# EAGLE design LED_Light_RS232_ZG (EAGLE 6.5.0)
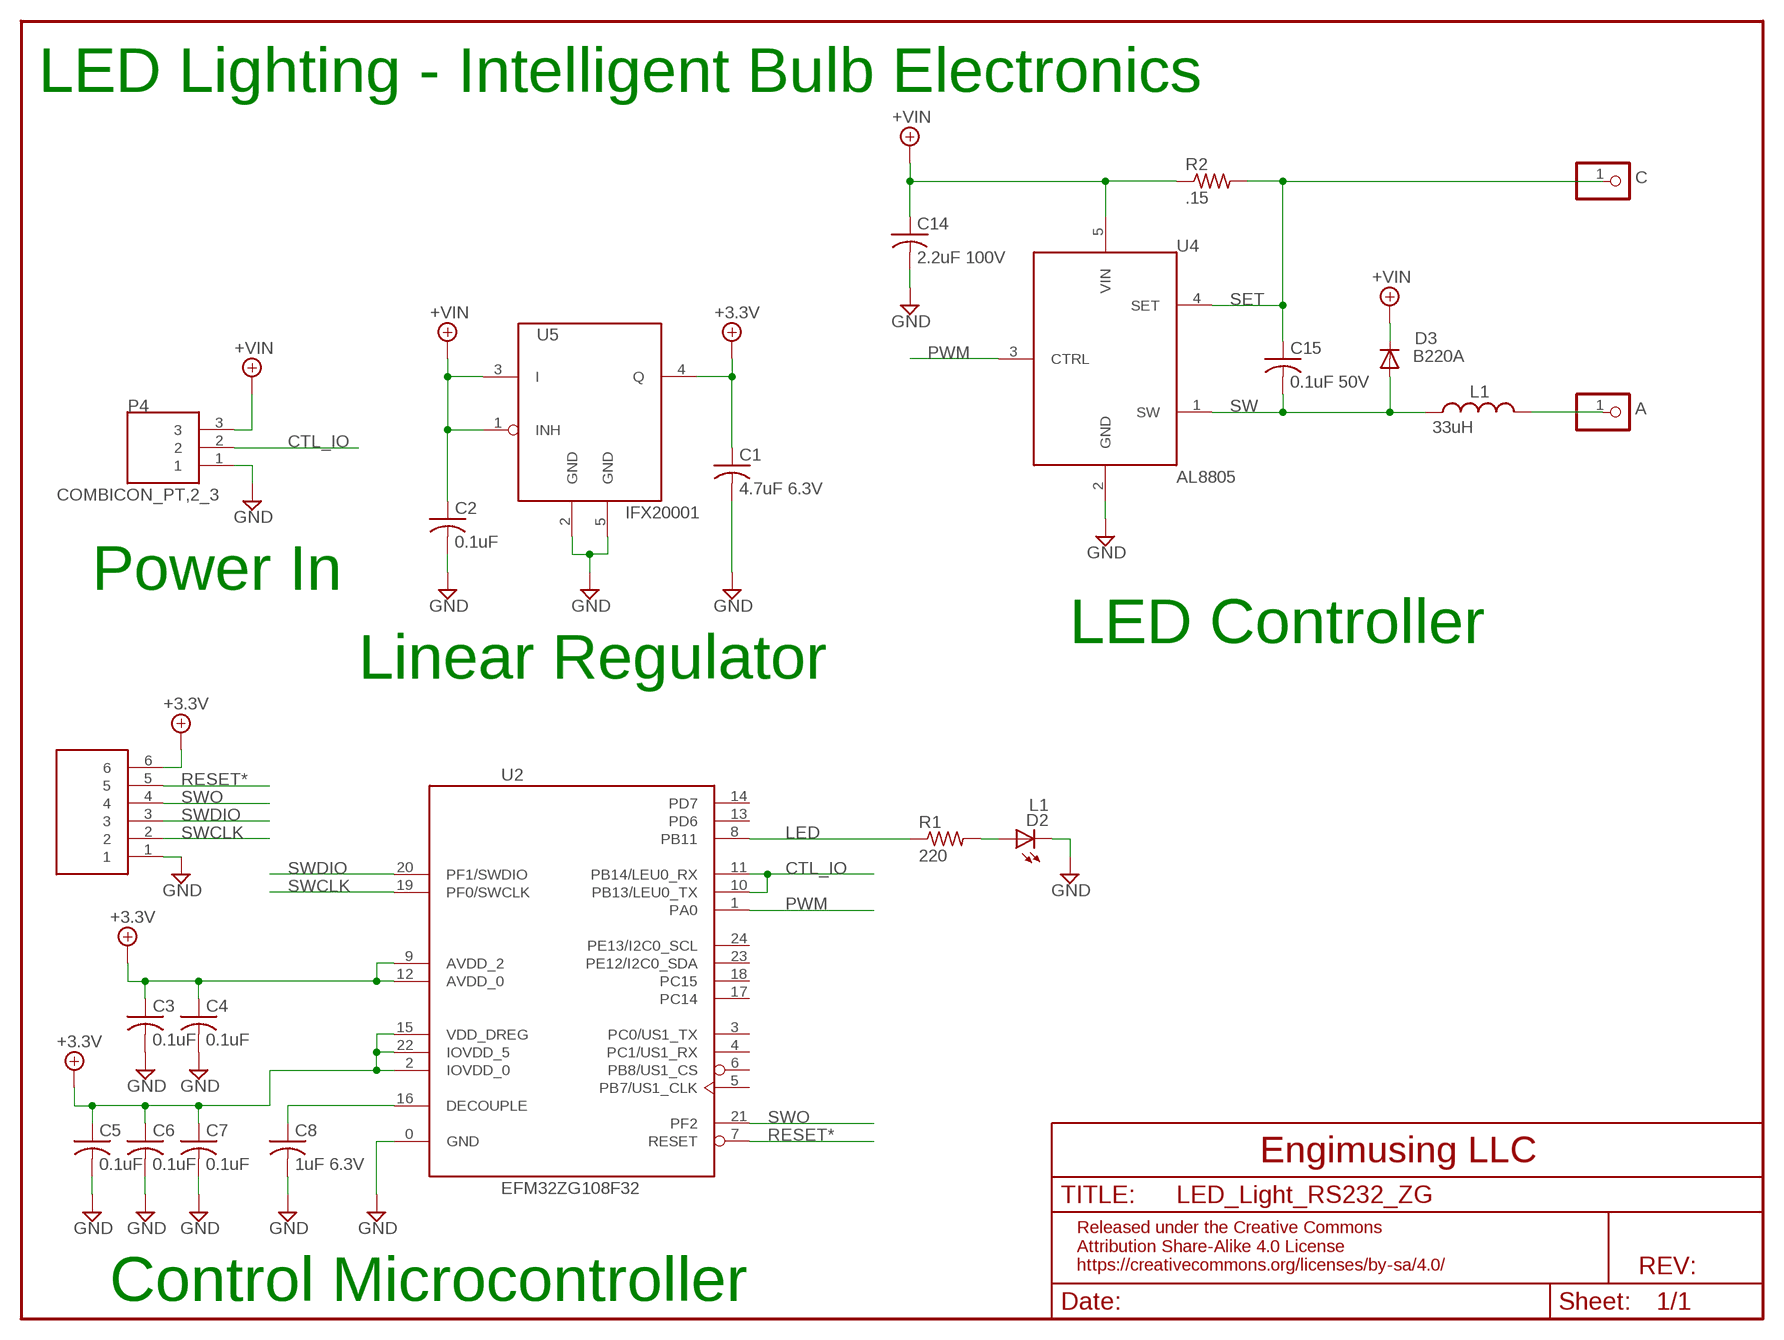
[diagram p0: schematic, sheet 1]

## Parts
A  PINHD-1X1  [1X01]
C  PINHD-1X1  [1X01]
C1  4.7uF 6.3V  C-USC0603  [C0603]
C2  0.1uF  C-USC0603  [C0603]
C3  0.1uF  C-USC0402  [C0402]
C4  0.1uF  C-USC0402  [C0402]
C5  0.1uF  C-USC0402  [C0402]
C6  0.1uF  C-USC0402  [C0402]
C7  0.1uF  C-USC0402  [C0402]
C8  1uF 6.3V  C-USC0603  [C0603]
C14  2.2uF 100V  C-USC1210K  [C1210K]
C15  0.1uF 50V  C-USC0603  [C0603]
D2  L1  LEDCHIP-LED0603  [CHIP-LED0603]
D3  B220A  DIODE  [DO214SMA]
L1  33uH  INDUCTOR  [SRN6045]
P3  DF11-6_STRAIGHT_PIN  [DF11SP-6-H]
P4  COMBICON_PT,2_3  [PT_2,5/3-5,0-H]
R1  220  R-USR0402  [R0402]
R2  .15  R-USR0805  [R0805]
U2  EFM32ZG108F32  [QFN24_5X5]
U4  AL8805  [SOT-23-5A]
U5  IFX20001  [PG-SCT595-5]

## Nets
+3.3V: C1.1 C3.1 C4.1 C5.1 C6.1 C7.1 P3.6 U2.2(IOVDD_0) U2.9(AVDD_2) U2.12(AVDD_0) U2.15(VDD_DREG) U2.22(IOVDD_5) U5.4(Q)
+VIN: C2.1 C14.1 D3.1(C) P4.3 R2.1 U4.5(VIN) U5.1(INH) U5.3(I)
CTL_IO: P4.2 U2.10(PB13/LEU0_TX) U2.11(PB14/LEU0_RX)
GND: C1.2 C2.2 C3.2 C4.2 C5.2 C6.2 C7.2 C8.2 C14.2 D2.C P3.1 P4.1 U2.0(GND) U4.2(GND) U5.2(GND) U5.5(GND)
LED: R1.1 U2.8(PB11)
N$1: C8.1 U2.16(DECOUPLE)
N$4: A.1 L1.2
N$5: D2.A R1.2
PWM: U2.1(PA0) U4.3(CTRL)
RESET*: P3.5 U2.7(RESET)
SET: C15.1 C.1 R2.2 U4.4(SET)
SW: C15.2 D3.2(A) L1.1 U4.1(SW)
SWCLK: P3.2 U2.19(PF0/SWCLK)
SWDIO: P3.3 U2.20(PF1/SWDIO)
SWO: P3.4 U2.21(PF2)
Unconnected: U2.3(PC0/US1_TX) U2.4(PC1/US1_RX) U2.5(PB7/US1_CLK) U2.6(PB8/US1_CS) U2.13(PD6) U2.14(PD7) U2.17(PC14) U2.18(PC15) U2.23(PE12/I2C0_SDA) U2.24(PE13/I2C0_SCL)

## Notes on the sheet
- LED Lighting - Intelligent Bulb Electronics
- Power In
- LED Controller
- Linear Regulator
- Control Microcontroller

## Library data of the parts
A C = pinhead:PINHD-1X1: PIN HEADER
C1 C2 C8 C14 = Engimusing:C-US: CAPACITOR, American symbol
C3-C7 C15 = cc_rcl:C-US: CAPACITOR, American symbol
D2 = led:LED: LED OSRAM: - CHIPLED LG R971, LG N971, LY N971, LG Q971, LY Q971, LO R971, LY R971 LH N974, LH R974 LS Q976, LO Q976, LY Q976 LO Q996 - Hyper CHIPLED LW Q18S LB Q993, LB Q99A, LB R99A - SideLED LS A670, LO A670, LY A670, LG A670, LP A670 LB A673, LV A673, LT A673, LW A673 LH A674 LY A675 LS A676, LA A676, LO A676, LY A676, LW A676 LS A679, LY A679, LG A679 - Hyper Micro SIDELED® LS Y876, LA Y876, LO Y876, LY Y876 LT Y87S - SmartLED LW L88C, LW L88S LB L89C, LB L89S, LG L890 LS L89K, LO L89K, LY L89K LS L896, LA L896, LO L896, LY L896 - TOPLED LS T670, LO T670, LY T670, LG T670, LP T670 LSG T670, LSP T670, LSY T670, LOP T670, LYG T670 LG T671, LOG T671, LSG T671 LB T673, LV T673, LT T673, LW T673 LH T674 LS T676, LA T676, LO T676, LY T676, LB T676, LH T676, LSB T676, LW T676 LB T67C, LV T67C, LT T67C, LS T67K, LO T67K, LY T67K, LW E67C LS E67B, LA E67B, LO E67B, LY E67B, LB E67C, LV E67C, LT E67C LW T67C LS T679, LY T679, LG T679 LS T770, LO T770, LY T770, LG T770, LP T770 LB T773, LV T773, LT T773, LW T773 LH T774 LS E675, LA E675, LY E675, LS T675 LS T776, LA T776, LO T776, LY T776, LB T776 LHGB T686 LT T68C, LB T68C - Hyper Mini TOPLED® LB M676 - Mini TOPLED Santana® LG M470 LS M47K, LO M47K, LY M47K Source: http://www.osram.convergy.de LUXEON: - LUMILED® LXK2-PW12-R00, LXK2-PW12-S00, LXK2-PW14-U00, LXK2-PW14-V00 LXK2-PM12-R00, LXK2-PM12-S00, LXK2-PM14-U00 LXK2-PE12-Q00, LXK2-PE12-R00, LXK2-PE12-S00, LXK2-PE14-T00, LXK2-PE14-U00 LXK2-PB12-K00, LXK2-PB12-L00, LXK2-PB12-M00, LXK2-PB14-N00, LXK2-PB14-P00, LXK2-PB14-Q00 LXK2-PR12-L00, LXK2-PR12-M00, LXK2-PR14-Q00, LXK2-PR14-R00 LXK2-PD12-Q00, LXK2-PD12-R00, LXK2-PD12-S00 LXK2-PH12-R00, LXK2-PH12-S00 LXK2-PL12-P00, LXK2-PL12-Q00, LXK2-PL12-R00 Source: www.luxeon.com KINGBRIGHT: KA-3528ASYC Source: www.kingbright.com
D3 = Engimusing:DIODE: Diode SMA Model Volts Amps Type Vf Vr Digikey # Notes SSA34-E3 40V 3A Schottky 480mV @ 3A 200uA @ 40V SSA34-E3/61TGITR-ND CDBA120-G 20V 1A Schottky 500mV @ 1A 500uA @ 20V 641-1014-6-ND REEL MBRA210 10V 2A Schottky 350mV @ 2A 700uA @ 10V MBRA210LT3 SOD-123 Model Volts Amps Type Vf Vr Order # Notes BAT54T1G 30V 200mA Schottky 800mV @ 200mA 2uA @ 25V BAT54T1GOSTR-ND B0530W 30V 500mA Schottky 430mV @ 500mA 130uA @ 30V B0530W-FDICT-ND REEL MBR120 1A 20V Schottky 340mV @ 1A MBR120VLSFT1GOSCT-ND SOD-323 Model Volts Amps Type Vf Vr Order # Notes PMEG2005EJ 20V 500mA Schottky 355mV @ 500mA 568-4110-1-ND ZLLS410 10V 570mA Schottky 380mV @ 570mA ZLLS410CT-ND 1N4148WS 75V 150mA Silicon/Simple 1V 1N4148WSFSCT-ND REEL SOD-523 Model Volts Amps Type Vf Vr Order # Notes BAT54XV2 30V 200mA Schottky 0.8V @ 100mA BAT54XV2CT-ND TB751S 30V 30mA Schottky RB751S-40TE61CT-ND SOT23-R/W (R = Solder Paste/Reflow Ovens, W = Hand-Soldering) Model Volts Amps Type Vf Vr Order # Notes BAT54FILM 40V 300mA Schottky 497-7162-1-ND
L1 = Engimusing:INDUCTOR
P3 = engimusing_conectors:DF11-6: CONNEECTOR 6 POS SM
P4 = Engimusing:COMBICON_PT,2_3: CONNECTOR 3POS SCREW CONECTION
R1 = cc_rcl:R-US: RESISTOR, American symbol
R2 = Engimusing:R-US: RESISTOR, American symbol
U2 = Engimusing:EFM32ZG108
U4 = Engimusing:AL8805
U5 = Engimusing:IFX20001

## Net classes
2 gnd: width 0.254 mm, drill 0.61 mm, clearance 0.254 mm

## Board
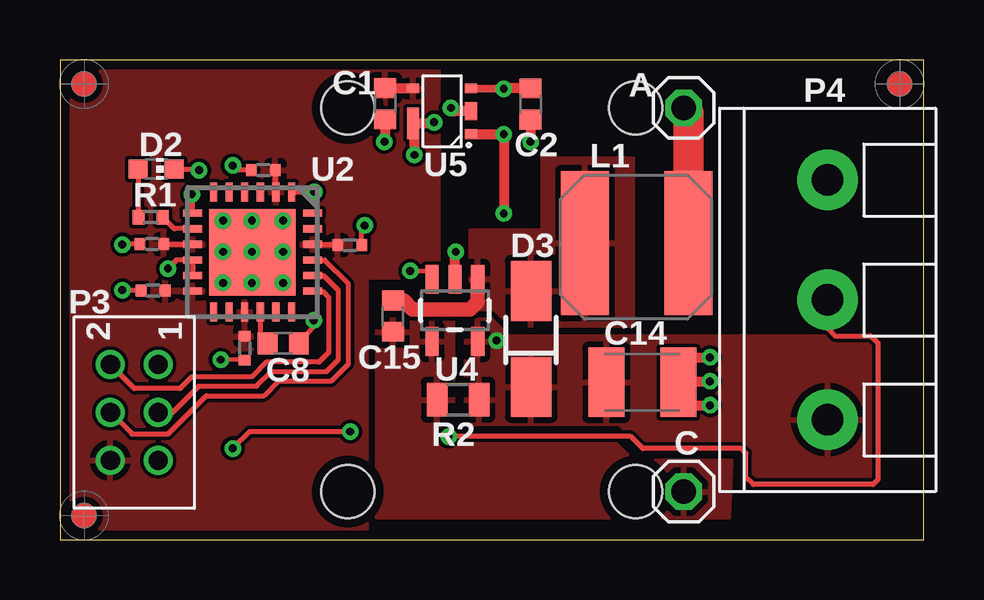
[diagram p1: board, top side]
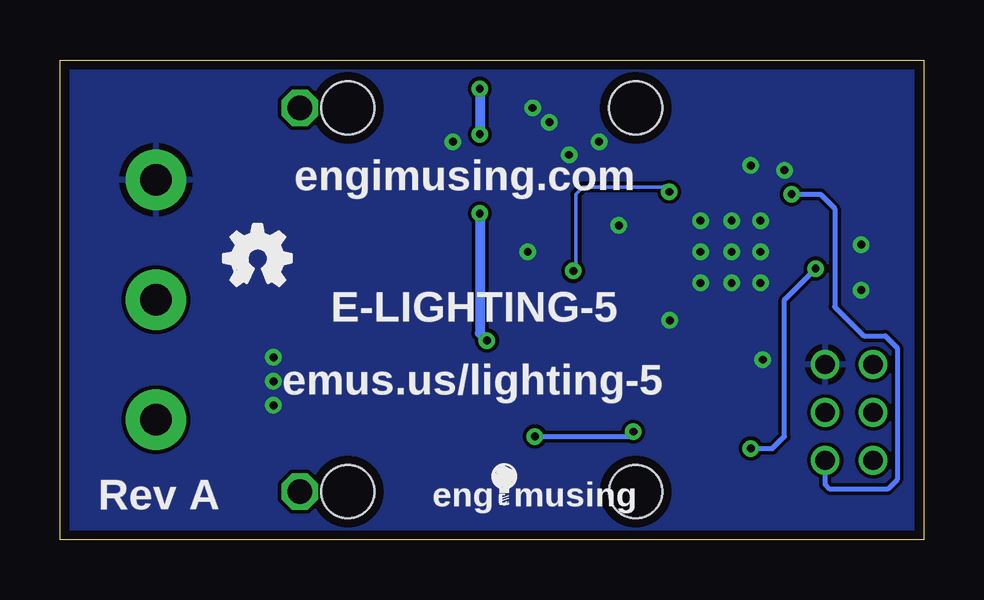
[diagram p2: board, bottom side, seen from below]

Size 36 x 20 mm. Coordinates in mm from the lower left corner, seen from the top.
Outline: 0,20 0,0 36,0 36,20 0,20
Copper layers (1*16): Top 0.0356mm / dielectric 1.5011mm / Bottom 0.0356mm
Design rules "OshPark-2Lyr *": minimum track width 6mil, minimum drill 13mil, track to track 6mil, track to pad 6mil, pad to pad 6mil, via to via 6mil, smd to smd 6mil, copper to edge 15mil, drill to drill 6mil, minimum pad ring 7mil, minimum via ring 7mil, stop-mask expansion 3mil, vias tented up to drill 13mil, thermal gap 10mil
Holes 2.2 mm at 24,18 24,2 12,2 12,18

### Footprints (pad centres in the part's own frame; a part is rotated, then mirrored left to right if it is on the bottom)
1X01 = drill 1.016 octagon: 1 0,0
C0603 = smd 0.825 x 0.925: 1 -0.65,0; 2 0.65,0
C0402 = smd 0.45 x 0.5: 1 -0.5,0; 2 0.5,0
C1210K = smd 1.5 x 2.9: 1 -1.5,0; 2 1.5,0
CHIP-LED0603 = smd 0.8 x 0.8: A 0,-0.75; C 0,0.75
DO214SMA = smd 2.5 x 1.7: 1 -2,0; 2 2,0
SRN6045 = smd 2 x 6: 1 -2.15,0; 2 2.15,0
DF11SP-6-H = drill 0.8: 1 2,-1; 2 2,1; 3 0,-1; 4 0,1; 5 -2,-1; 6 -2,1
PT_2,5/3-5,0-H = drill 1.3 pad 2.54: 1 -5,0; 2 0,0; 3 5,0
R0402 = smd 0.5 x 0.6: 1 -0.5,0; 2 0.5,0
R0805 = smd 0.85 x 1.4: 1 -0.875,0; 2 0.875,0
QFN24_5X5 = smd 3.6 x 3.6: 0 0,0 | smd 0.8 x 0.3: 1 -2.5,1.625; 2 -2.5,0.975; 3 -2.5,0.325; 4 -2.5,-0.325; 5 -2.5,-0.975; 6 -2.5,-1.625; 13 2.5,-1.625; 14 2.5,-0.975; 15 2.5,-0.325; 16 2.5,0.325; 17 2.5,0.975; 18 2.5,1.625 | smd 0.3 x 0.8: 7 -1.625,-2.5; 8 -0.975,-2.5; 9 -0.325,-2.5; 10 0.325,-2.5; 11 0.975,-2.5; 12 1.625,-2.5; 19 1.625,2.5; 20 0.975,2.5; 21 0.325,2.5; 22 -0.325,2.5; 23 -0.975,2.5; 24 -1.625,2.5
SOT-23-5A = smd 0.55 x 1.2: 1 -0.95,-1.3; 2 0,-1.3; 3 0.95,-1.3; 4 0.95,1.3; 5 -0.95,1.3
PG-SCT595-5 = smd 0.4 x 0.5: 1 -0.95,-1.2; 3 0.95,-1.2; 4 0.95,1.2 | smd 0.75 x 0.5: 2 0,-1.2 | smd 1.3 x 0.5: 5 -0.5,1.2

### Placement (x,y rotation side)
A  26,18 0 top
C  26,2 0 top
C1  13.55,18.17 270 top
C2  19.62,18.16 270 top
C3  3.83,12.32 180 top
C4  3.89,10.39 180 top
C5  7.71,7.98 270 top
C6  12.08,12.27 0 top
C7  8.48,15.41 180 top
C8  9.31,8.18 0 top
C14  24.27,6.56 0 top
C15  13.88,9.31 90 top
D2  4.01,15.45 270 top
D3  19.64,8.37 90 top
L1  24.04,12.36 0 top
P3  3.1,5.3 90 top
P4  32,10 270 top
R1  3.78,13.44 180 top
R2  16.6,5.83 180 top
U2  8.03,11.98 270 top
U4  16.46,9.56 180 top
U5  15.93,17.86 90 top
U$1  [FIDUCIAL_G10]  35,19 270 top
U$2  [FIDUCIAL_G10]  1,1 270 top
U$3  [OSHW_FILLX100_NOTEXT]  29.18,10.6 0 bottom
U$4  [LOGO]  16.11,1.72 0 bottom
U$5  [FIDUCIAL_G10]  1,19 270 top

### Tracks (layer width: path | path; a pad name or v marks a point on that pad's centre or on a via)
+3.3V
  Top 0.2: C7.1 8.98,14.51 U2.2 | U2.22 11.65,12.31 C6.1 | U2.9 4.35,12.31 C3.1
  Top 0.406: U5.4 13.57,18.81 C1.1
  pour Top: 0,0 0,20 15.8,20 15.8,10.9 12.8,10.9 12.8,0
+VIN  (via drill 0.33 pad 0.61)
  Top 0.305: U5.3 v18.49,18.81 v18.5,18.8
  Top 0.406: U5.1 v18.49,16.91 v18.5,16.9 v18.5,13.6 | C2.1 18.51,18.81 v18.5,18.8
  Bottom 0.406: v18.5,18.8 v18.5,16.9 | v18.5,13.6 18.5,8.6 v18.2,8.3
  pour Top: 34,8.5 18.7,8.5 18,9.2 16.9,9.2 16.9,4.8 23.3,4.8 24.3,3.8 28.6,3.8 28.6,2.3 34.1,2.3
CTL_IO  (via drill 0.33 pad 0.61)
  Top 0.2: U2.11 U2.10 4.86,11.66 v4.5,11.3 | P4.2 32,8.8 32.3,8.5 33.8,8.5 34.1,8.2 34.1,2.5 33.9,2.3 28.9,2.3 28.6,2.6 28.6,3.6 28.4,3.8 24.3,3.8 23.8,4.3 v16.2,4.3 | v12.1,4.5 7.9,4.5 v7.2,3.8
  Bottom 0.2: v16.2,4.3 12.3,4.3 v12.1,4.5 | v7.2,3.8 6.3,3.8 5.8,4.3 5.8,10 v4.5,11.3
GND  (via drill 0.33 pad 0.61)
  Top 0.2: C7.2 7.39,15.41 v7.2,15.6 | U2.0 8.03,12.07 v6.8,13.3 v8,13.3 | v8,13.3 v9.3,13.3 v9.3,12 v8,12 | v6.8,12 v8,12 | v8,12 v8,13.3 | v8,13.3 8,12.2 v9.3,10.7 8.1,10.9 v8,10.7 v6.8,10.7 | C4.2 2.71,10.39 v2.6,10.4 | C3.2 2.62,12.32 v2.6,12.3 | D2.C 5.75,15.45 v5.8,15.4 | C6.2 12.57,12.97 v12.7,13.1 | C5.2 7.61,7.51 v6.7,7.5 | C8.2 10.55,8.85 10.55,9.07 v10.58,9.14
  Top 0.406: v14.78,16.04 14.76,16.75 U5.5 15.46,17.36 v15.6,17.4 | U5.2 16.44,17.86 v16.3,18 | 25.8,7.6 v27.1,7.6 | 25.77,7.05 25.77,6.63 25.8,6.6 v27.1,6.6 | C14.2 25.77,5.63 25.8,5.6 v27.1,5.6 | U4.2 16.46,11.96 v16.5,12 | C2.2 19.62,16.71 v19.62,16.59 | C1.2 13.55,16.7 v13.52,16.59
  Top 0.61: C14.2 25.77,7.05 25.77,7.57 25.8,7.6
  pour Bottom: 0,20 0,0 36,0 36,20
LED
  Top 0.2: U2.8 4.76,12.96 R1.1
N$1
  Top 0.2: U2.16 8.35,8.58 C8.1
N$4
  Top 1.27: L1.2 26.19,17.81 A.1
N$5
  Top 0.2: D2.A 3.26,13.64 3.3,13.6 3.24,13.48 R1.2
PWM  (via drill 0.33 pad 0.61)
  Top 0.2: U4.3 15.51,11.19 v14.6,11.2 | U2.1 10.58,14.48 v10.6,14.5
  Bottom 0.152: 10.8,14.7 14.2,14.7 14.5,14.4 14.5,11.3 v14.6,11.2
  Bottom 0.2: 10.8,14.7 v10.6,14.5
RESET*  (via drill 0.33 pad 0.61)
  Top 0.2: U2.7 5.53,14.37 v5.5,14.4
  Bottom 0.2: v5.5,14.4 4.3,14.4 3.7,13.8 3.7,9.7 2.5,8.5 1.6,8.5 1.1,8 1.1,2.5 1.5,2.1 3.9,2.1 4.1,2.3 P3.5
SET
  pour Top: 16.4,4.2 16.4,9.2 13.2,9.2 13.2,0.9 27.9,0.9 28,3.3 23.9,3.3 23,4.2
SW
  Top 0.61: C15.2 14.34,9.96 14.7,9.6 17.1,9.6 17.4,9.9 17.4,10.84 U4.1
  pour Top: 23.9,15.9 20.1,15.9 20.1,12.9 17.1,12.9 17.1,9.6 18.1,9.6 18.8,8.9 23.9,8.9
SWCLK
  Top 0.2: U2.19 10.94,10.36 11.2,10.1 11.2,7.8 10.8,7.4 8.6,7.4 8,6.8 5.5,6.8 5,6.3 3.1,6.3 P3.2
SWDIO
  Top 0.2: U2.20 10.99,11.01 11.6,10.4 11.6,7.5 11.1,7 8.8,7 8.2,6.4 5.8,6.4 4.7,5.3 P3.3
SWO
  Top 0.2: U2.21 11.04,11.66 12,10.7 12,7.3 11.3,6.6 9.1,6.6 8.5,6 6.1,6 4.5,4.4 3,4.4 P3.4

### Text on the board
bPlace: engimusing.com | E-LIGHTING-5 | emus.us/lighting-5 | Rev A